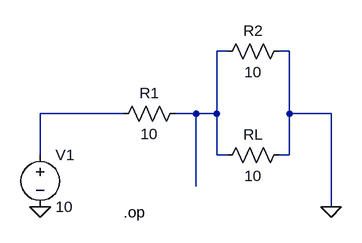
[diagram p0: schematic vd4.asc]
vd4.asc, the LTspice schematic file:
Version 4
SHEET 1 880 680
WIRE 512 128 496 128
WIRE 608 128 592 128
WIRE 352 224 224 224
WIRE 464 224 432 224
WIRE 496 224 496 128
WIRE 496 224 464 224
WIRE 608 224 608 128
WIRE 672 224 608 224
WIRE 224 288 224 224
WIRE 496 288 496 224
WIRE 512 288 496 288
WIRE 608 288 608 224
WIRE 608 288 592 288
WIRE 464 336 464 224
WIRE 672 368 672 224
FLAG 224 368 0
FLAG 672 368 0
SYMBOL voltage 224 272 R0
SYMATTR InstName V1
SYMATTR Value 10
SYMBOL Res 448 208 R90
WINDOW 0 0 56 VBottom 2
WINDOW 3 32 56 VTop 2
SYMATTR InstName R1
SYMATTR Value 10
SYMBOL Res 608 112 R90
WINDOW 0 0 56 VBottom 2
WINDOW 3 32 56 VTop 2
SYMATTR InstName R2
SYMATTR Value 10
SYMBOL Res 608 272 R90
WINDOW 0 0 56 VBottom 2
WINDOW 3 32 56 VTop 2
SYMATTR InstName RL
SYMATTR Value 10
TEXT 352 376 Left 2 !.op

The netlist it stands for:
* vd4.asc
V1 N002 0 10
R1 N001 N002 10
R2 0 N001 10
RL 0 N001 10
.op
.backanno
.end